# Altium schematic sheet Sheet7.SchDoc
size A4; SheetNumber: 1; SheetTotal: 1
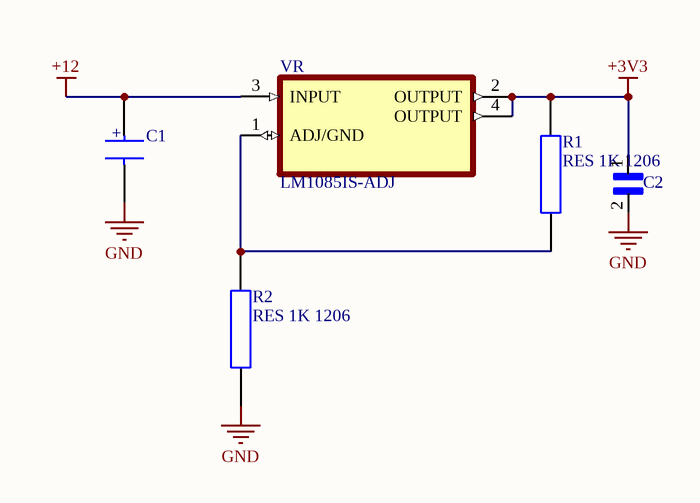
[diagram p0: Sheet7.SchDoc]

## Parts
C1  CAP 100nF 0805  [CAP_805]  (value not drawn)
C2  T491C106K025AT  [CAPPC6032X280N]  (value not drawn)
R1  RES 1K 1206  [RES_1206]
R2  RES 1K 1206  [RES_1206]
VR  LM1085IS-ADJ  [TO254P1524X483-4N]

## Nets
+3V3: C2.1 R1.2 VR.2(OUTPUT) VR.4(OUTPUT)
+12: C1.1 VR.3(INPUT)
GND: C1.2 C2.2 R2.1
NetR1_1: R1.1 R2.2 VR.1(ADJ/GND)

## Notes on the sheet
- (in symbol CAP 100nF 0805) +

## Library data of the parts
C1 = CAP 100nF 0805: 0805 smd
C2 = T491C106K025AT: 10 ÂµF Molded Tantalum Capacitors 25 V 2312 (6032 Metric) 1.5Ohm; MF: KEMET; Value: *; SnapEDA_Link: https://www.snapeda.com/parts/T491C106K025AT/KEMET/view-part/?ref=snap; Purchase-URL: https://pricing.snapeda.com/search/part/T491C106K025AT/?ref=eda; Availability: In Stock; Price: None; Package: SMD-2 KEMET; Check_prices: https://www.snapeda.com/parts/T491C106K025AT/KEMET/view-part/?ref=eda; MP: T491C106K025AT
VR = LM1085IS-ADJ: 3-A, 29-V, linear voltage regulator 3-DDPAK/TO-263; MF: Texas Instruments; SnapEDA_Link: https://www.snapeda.com/parts/LM1085IS-ADJ/Texas%20Instruments/view-part/213969/?ref=snap; Price: None; MP: LM1085IS-ADJ; Availability: Unavailable; Mouser-Purchase-URL: https://snapeda.com/shop?store=Mouser&id=213969; Value: *; Arrow_Electronics-Purchase-URL: https://snapeda.com/shop?store=Arrow+Electronics&id=213969; DigiKey-Purchase-URL: https://snapeda.com/shop?store=DigiKey&id=213969; Package: TO-263-3 Texas Instruments